# Altium schematic sheet Sheet2.SchDoc
size A; SheetNumber: 1; SheetTotal: 1
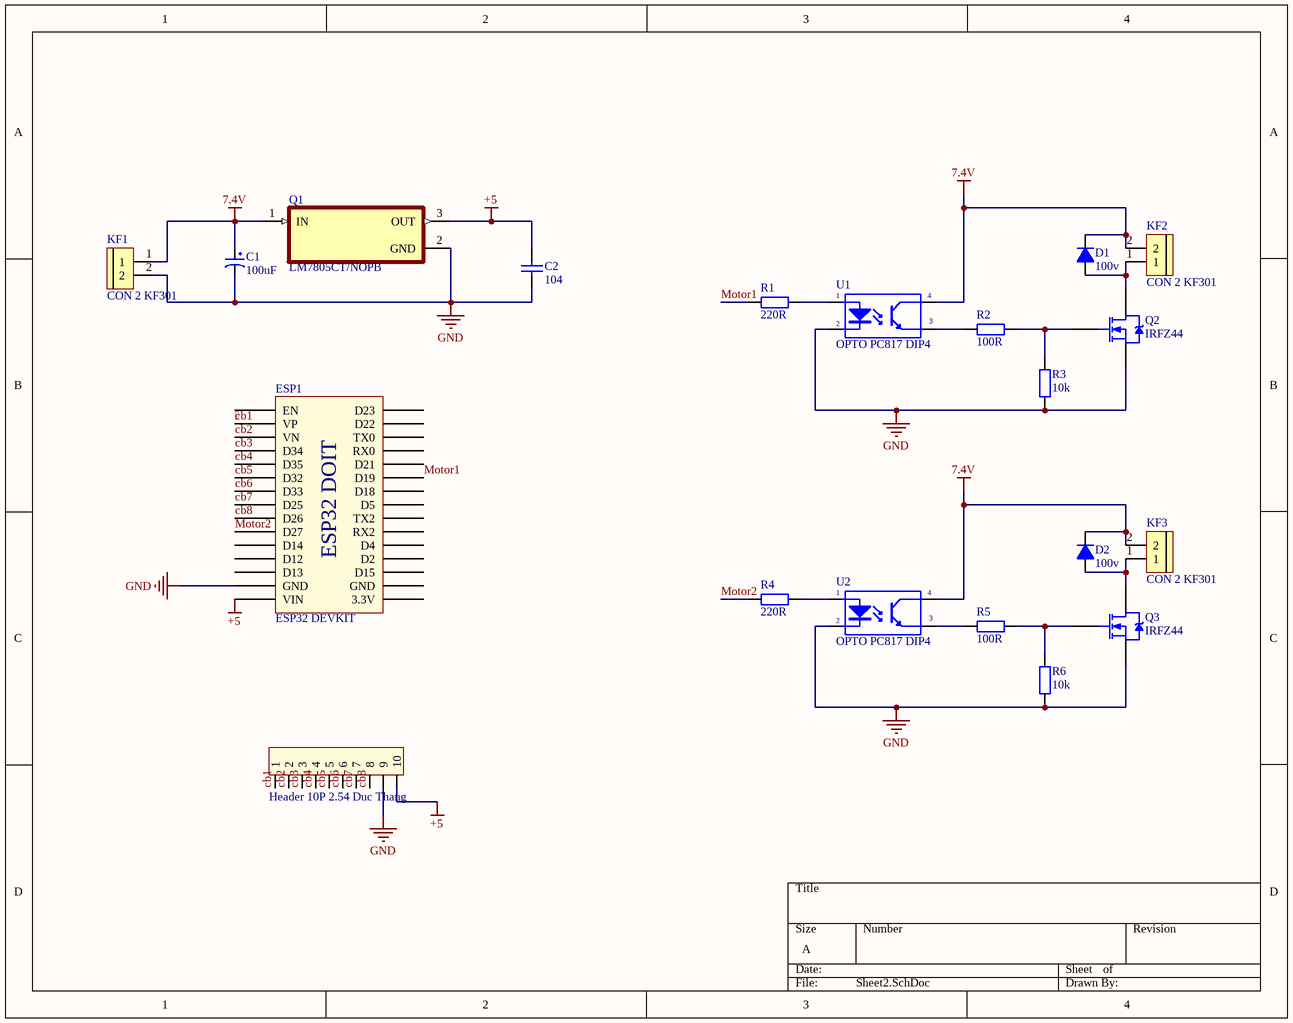
[diagram p0: Sheet2.SchDoc]

## Parts
C1  100uF  [tu hoa 5mm]
C2  104  [tu gom]
D1  100v  [DIODE 1A]
D2  100v  [DIODE 1A]
ESP1  ESP32 DEVKIT  [ESP32 WROOM 32 KIT]
H1  Header 10P 2.54 Duc Thang  [XH2.54M-10]
KF1  CON 2 KF301  [Con 2 KF301 5.08]
KF2  CON 2 KF301  [Con 2 KF301 5.08]
KF3  CON 2 KF301  [Con 2 KF301 5.08]
Q1  LM7805CT/NOPB  [TO254P1054X470X1955-3]
Q2  IRFZ44  [TO220]
Q3  IRFZ44  [TO220]
R1  220R  [tro vach 1/4w]
R2  100R  [tro vach 1/4w]
R3  10k  [tro vach 1/4w]
R4  220R  [tro vach 1/4w]
R5  100R  [tro vach 1/4w]
R6  10k  [tro vach 1/4w]
U1  OPTO PC817 DIP4  [DIP4]
U2  OPTO PC817 DIP4  [DIP4]

## Nets
7.4V: C1.1 D1.2(K) D2.2(K) KF1.1 KF2.2 KF3.2 Q1.1(IN) U1.4(C) U2.4(C)
+5: C2.1 ESP1.15(VIN) H1.10 Q1.3(OUT)
GND: C1.2 C2.2 ESP1.14(GND) H1.9 KF1.2 Q1.2(GND) Q2.3(S) Q3.3(S) R3.1 R6.1 U1.2(K) U2.2(K)
: ESP1.2(VP) H1.1  [also labelled cb1]
cb2: ESP1.3(VN) H1.2
cb3: ESP1.4(D34) H1.3
cb4: ESP1.5(D35) H1.4
cb5: ESP1.6(D32) H1.5
cb6: ESP1.7(D33) H1.6
cb7: ESP1.8(D25) H1.7
cb8: ESP1.9(D26) H1.8
Motor1: ESP1.25(D19) R1.1
Motor2: ESP1.10(D27) R4.1
NetD1_1: D1.1(A) KF2.1 Q2.2(D)
NetD2_1: D2.1(A) KF3.1 Q3.2(D)
NetQ2_1: Q2.1(G) R2.2 R3.2
NetQ3_1: Q3.1(G) R5.2 R6.2
NetR1_2: R1.2 U1.1(A)
NetR2_1: R2.1 U1.3(E)
NetR4_2: R4.2 U2.1(A)
NetR5_1: R5.1 U2.3(E)

Not connected (* = marked no-connect by the designer): ESP1 1(EN) 11(D14) 12(D12) 13(D13) 16(3.3V) 17(GND) 18(D15) 19(D2) 20(D4) 21(RX2) 22(TX2) 23(D5) 24(D18) 26(D21) 27(RX0) 28(TX0) 29(D22) 30(D23)

## Notes on the sheet
- (in symbol ESP32 WROOM 32 KIT) ESP32 DOIT

## Library data of the parts
C1 = Tu Hoa 100uF 16V 5x7: Cắm; Don_Vi: Con; So_Chan: 2; Ten_Linh_Kien: Tụ Hóa 100uF 16V 5x7MM; Ma_Hang: MH001347; Chung_Loai: Cắm; Kieu_Chan: *
C2 = Tu gom 104 50V: Cắm; So_Chan: 2; Ten_Linh_Kien: Tụ gốm 104 100nF 50V; Don_Vi: Con; Ma_Hang: MH004761; Chung_Loai: Cắm; Kieu_Chan: *
D1 D2 = Diode 1N4007: Cắm; Ten_Linh_Kien: Diode 1N4007 1A (DIP); Don_Vi: Con; Ma_Hang: MH001063; Ghi Chu: *; Kieu_Chan: *; Chung_Loai: Cắm
ESP1 = ESP32 WROOM 32 KIT
H1 = Header 10P 2.54 Duc Thang: Cắm; Ten_Linh_Kien: Header 10P XH2.54-10P Đực Thẳng; Don_Vi: Con; Ma_Hang: MH001286; Chung_Loai: Cắm
KF1-KF3 = CON 2 KF301: Cắm; Ma_Hang: MH000987; Ten_Linh_Kien: CON 2 KF301-2P 5.08MM Xanh Dương; Chung_Loai: Cắm; Ghi_Chu: *; Kieu_Chan: *; Don_Vi: Con
Q1 = LM7805CT/NOPB: MF: {'manufacturer': u'Texas Instruments'}; Package: None; Price: None; Value: *; MP: LM7805CT/NOPB; Availability: Unavailable
Q2 Q3 = FET IRFZ44 DIP: TO-220
R1 R4 = Tro Vach 1/4W 5% 220R: Cắm; Don_Vi: Con; So_Chan: 2; Ten_Linh_Kien: Trở Vạch 1/4w 5% 220R; Ma_Hang: MH007300; Chung_Loai: Cắm; Kieu_Chan: *
R2 R5 = Tro Vach 1/4W 5% 100R: Cắm; Don_Vi: Con; So_Chan: 2; Ten_Linh_Kien: Trở Vạch 1/4w 5% 100R; Ma_Hang: MH007353; Chung_Loai: Cắm; Kieu_Chan: *
R3 R6 = Tro Vach 1/4W 1% 10k: Cắm; Don_Vi: Con; So_Chan: 2; Ten_Linh_Kien: Trở Vạch 1/4w 1% 10k; Ma_Hang: MH006349; Chung_Loai: Cắm; Kieu_Chan: *
U1 U2 = OPTO PC817 DIP4: Single Opto; Value: PC817